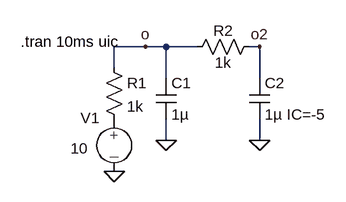
[diagram p0: schematic RC-Glied_mit_anfangsbedingung.asc]
RC-Glied_mit_anfangsbedingung.asc, the LTspice schematic file:
Version 4
SHEET 1 880 680
WIRE 208 112 160 112
WIRE 240 112 208 112
WIRE 288 112 240 112
WIRE 384 112 368 112
WIRE 160 144 160 112
WIRE 240 160 240 112
WIRE 384 160 384 112
WIRE 240 256 240 224
WIRE 384 256 384 224
FLAG 160 304 0
FLAG 240 256 0
FLAG 208 112 o
FLAG 384 256 0
FLAG 384 112 o2
SYMBOL cap 224 160 R0
SYMATTR InstName C1
SYMATTR Value 1µ
SYMBOL res 144 128 R0
SYMATTR InstName R1
SYMATTR Value 1k
SYMBOL source-V 160 208 R0
WINDOW 0 -52 14 Left 2
WINDOW 3 -67 61 Left 2
SYMATTR InstName V1
SYMATTR Value 10
SYMBOL res 384 96 R90
WINDOW 0 7 56 VBottom 2
WINDOW 3 25 56 VTop 2
SYMATTR InstName R2
SYMATTR Value 1k
SYMBOL cap 368 160 R0
SYMATTR InstName C2
SYMATTR Value 1µ IC=-5
TEXT 16 104 Left 2 !.tran 10ms uic

The netlist it stands for:
* RC-Glied_mit_anfangsbedingung.asc
C1 o 0 1µ
R1 o P001 1k
V1 P001 0 10
R2 o2 o 1k
C2 o2 0 1µ IC=-5
.tran 10ms uic
.backanno
.end